# EAGLE design BSeriesPlug (EAGLE 9.6.2)
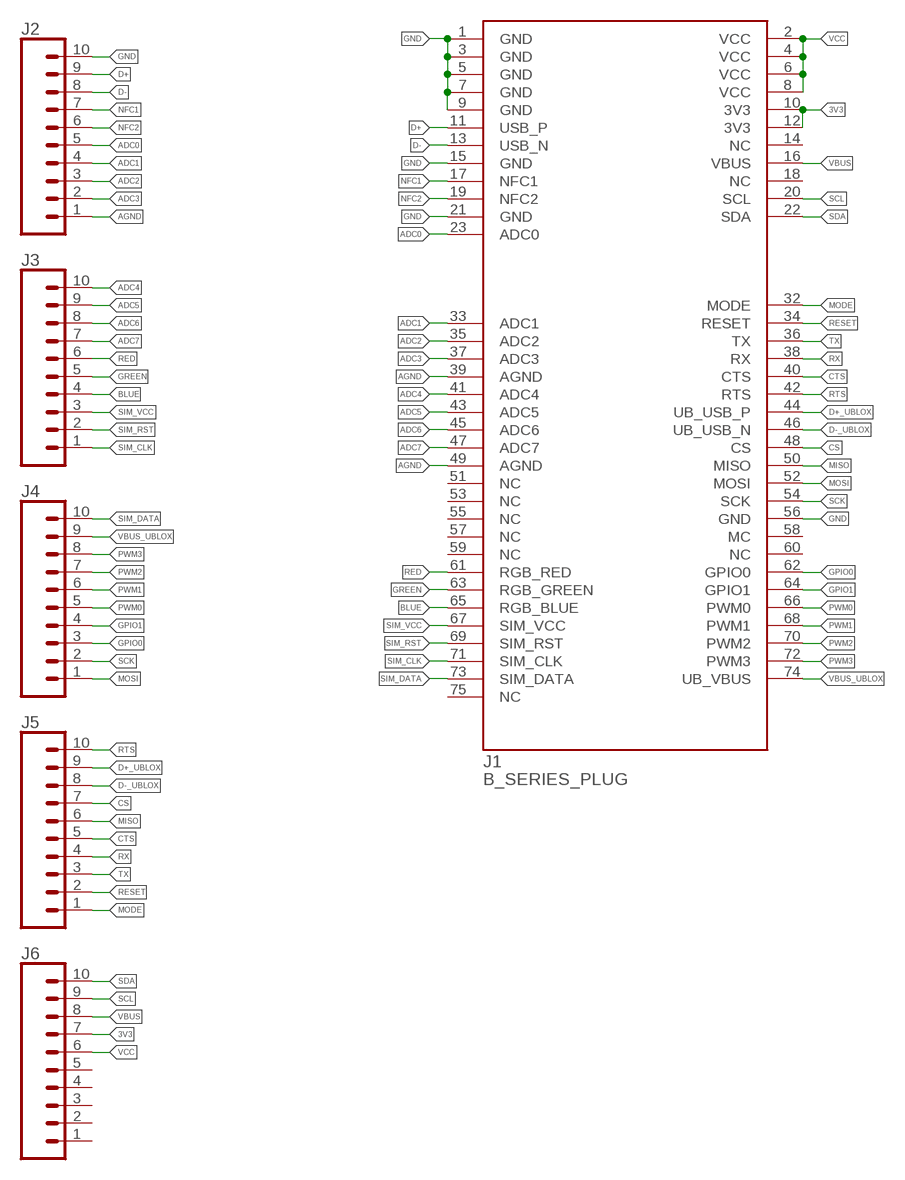
[diagram p0: schematic, sheet 1]

## Parts
J1  B_SERIES_PLUG  [M.2-CARD-E-22]
J2  CONN_10"  [1X10]
J3  CONN_10"  [1X10]
J4  CONN_10"  [1X10]
J5  CONN_10"  [1X10]
J6  CONN_10"  [1X10]

## Nets
3V3: J1.10(3V3) J1.12(3V3) J6.7
ADC0: J1.23(ADC0) J2.5
ADC1: J1.33(ADC1) J2.4
ADC2: J1.35(ADC2) J2.3
ADC3: J1.37(ADC3) J2.2
ADC4: J1.41(ADC4) J3.10
ADC5: J1.43(ADC5) J3.9
ADC6: J1.45(ADC6) J3.8
ADC7: J1.47(ADC7) J3.7
AGND: J1.39(AGND) J1.49(AGND) J2.1
BLUE: J1.65(RGB_BLUE) J3.4
CS: J1.48(CS) J5.7
CTS: J1.40(CTS) J5.5
D+: J1.11(USB_P) J2.9
D+_UBLOX: J1.44(UB_USB_P) J5.9
D-: J1.13(USB_N) J2.8
D-_UBLOX: J1.46(UB_USB_N) J5.8
GND: J1.1(GND) J1.3(GND) J1.5(GND) J1.7(GND) J1.9(GND) J1.15(GND) J1.21(GND) J1.56(GND) J2.10
GPIO0: J1.62(GPIO0) J4.3
GPIO1: J1.64(GPIO1) J4.4
GREEN: J1.63(RGB_GREEN) J3.5
MISO: J1.50(MISO) J5.6
MODE: J1.32(MODE) J5.1
MOSI: J1.52(MOSI) J4.1
NFC1: J1.17(NFC1) J2.7
NFC2: J1.19(NFC2) J2.6
PWM0: J1.66(PWM0) J4.5
PWM1: J1.68(PWM1) J4.6
PWM2: J1.70(PWM2) J4.7
PWM3: J1.72(PWM3) J4.8
RED: J1.61(RGB_RED) J3.6
RESET: J1.34(RESET) J5.2
RTS: J1.42(RTS) J5.10
RX: J1.38(RX) J5.4
SCK: J1.54(SCK) J4.2
SCL: J1.20(SCL) J6.9
SDA: J1.22(SDA) J6.10
SIM_CLK: J1.71(SIM_CLK) J3.1
SIM_DATA: J1.73(SIM_DATA) J4.10
SIM_RST: J1.69(SIM_RST) J3.2
SIM_VCC: J1.67(SIM_VCC) J3.3
TX: J1.36(TX) J5.3
VBUS: J1.16(VBUS) J6.8
VBUS_UBLOX: J1.74(UB_VBUS) J4.9
VCC: J1.2(VCC) J1.4(VCC) J1.6(VCC) J1.8(VCC) J6.6
Unconnected: J1.14(NC) J1.18(NC) J1.51(NC) J1.53(NC) J1.55(NC) J1.57(NC) J1.58(MC) J1.59(NC) J1.60(NC) J1.75(NC) J6.1 J6.2 J6.3 J6.4 J6.5

## Library data of the parts
J1 = bschulz:B_SERIES_PLUG
J2-J6 = bschulz:CONN_10: Genaric 10 terminal header Digikey 2.54_SCREW <https://www.digikey.com/product-detail/en/on-shore-technology-inc/OSTVN10A150/ED10567-ND/1588870> 3.5_SCREW <https://www.digikey.com/product-detail/en/on-shore-technology-inc/OSTTE100104/ED2735-ND/2351811>; PROD_ID: CONN-11563

## Board
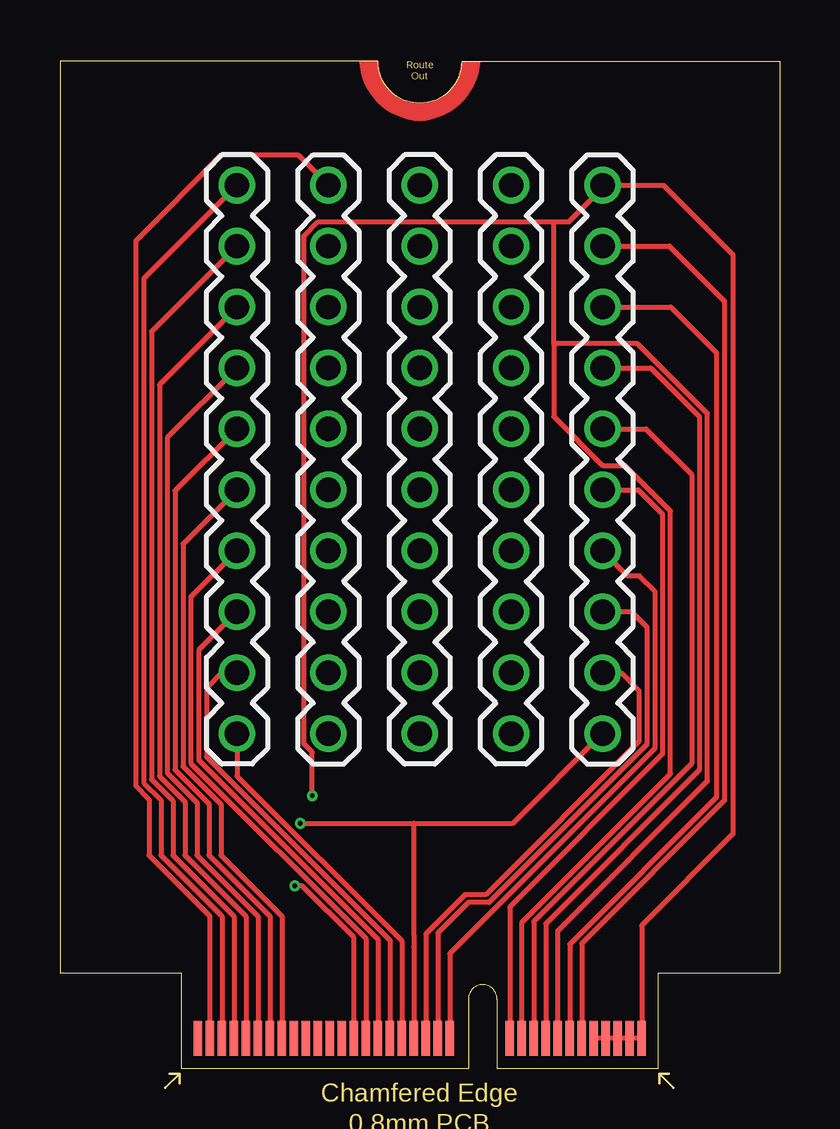
[diagram p1: board, top side]
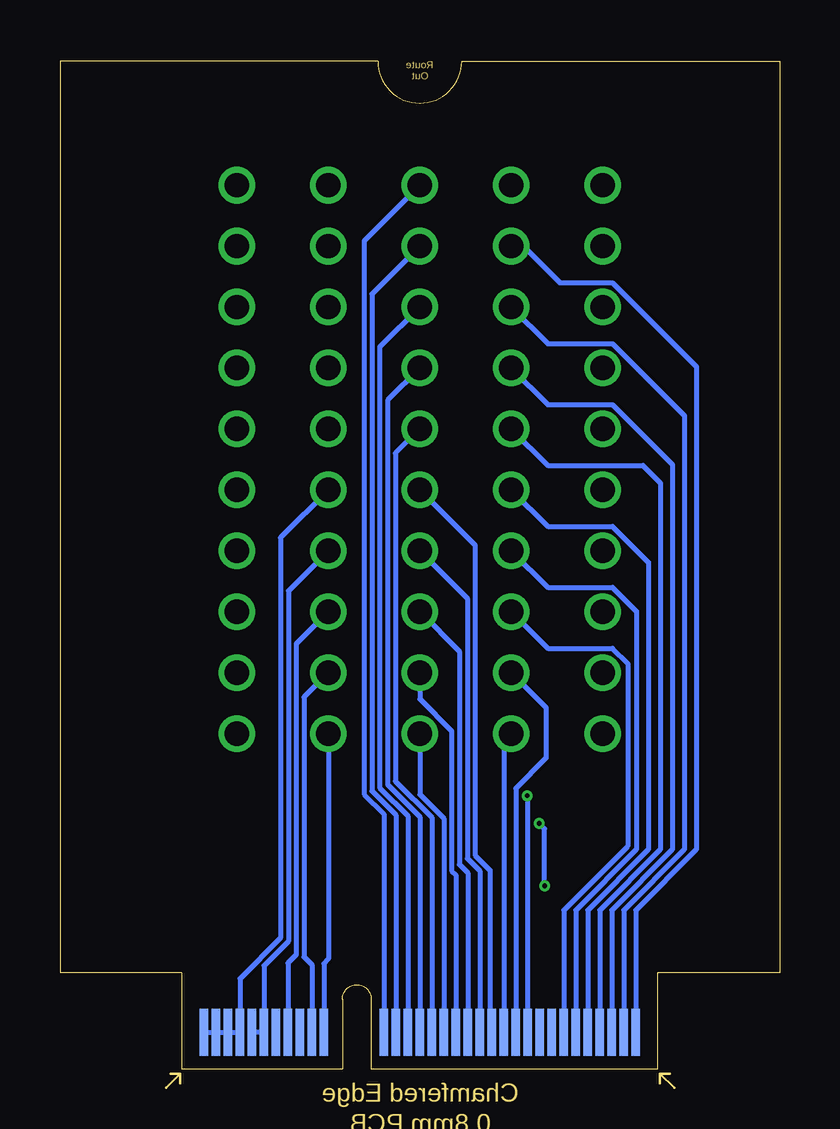
[diagram p2: board, bottom side, seen from below]

Size 30 x 42 mm. Coordinates in mm from the lower left corner, seen from the top.
Copper layers (1*16): Top 0.035559375mm / dielectric 1.6mm / Bottom 0.035559375mm
Design rules "jlcpcb-2layer": minimum track width 5mil, minimum drill 0.2mm, track to track 5mil, track to pad 6mil, pad to pad 5mil, via to via 6mil, smd to smd 5mil, copper to edge 15mil, drill to drill 6mil, minimum pad ring 5mil, minimum via ring 5mil, stop-mask expansion 2.5mil, vias tented up to drill 0mil, thermal gap 10mil

### Footprints (pad centres in the part's own frame; a part is rotated, then mirrored left to right if it is on the bottom)
M.2-CARD-E-22 = smd 0.35 x 1.45: 1 9.25,1.275; 3 8.75,1.275; 5 8.25,1.275; 7 7.75,1.275; 9 7.25,1.275; 11 6.75,1.275; 13 6.25,1.275; 15 5.75,1.275; 17 5.25,1.275; 19 4.75,1.275; 21 4.25,1.275; 23 3.75,1.275; 33 1.25,1.275; 35 0.75,1.275; 37 0.25,1.275; 39 -0.25,1.275; 41 -0.75,1.275; 43 -1.25,1.275; 45 -1.75,1.275; 47 -2.25,1.275; 49 -2.75,1.275; 51 -3.25,1.275; 53 -3.75,1.275; 55 -4.25,1.275; 57 -4.75,1.275; 59 -5.25,1.275; 61 -5.75,1.275; 63 -6.25,1.275; 65 -6.75,1.275; 67 -7.25,1.275; 69 -7.75,1.275; 71 -8.25,1.275; 73 -8.75,1.275; 75 -9.25,1.275 | smd 0.35 x 1.95 bottom: 2 9,1.525; 4 8.5,1.525; 6 8,1.525; 8 7.5,1.525; 10 7,1.525; 12 6.5,1.525; 14 6,1.525; 16 5.5,1.525; 18 5,1.525; 20 4.5,1.525; 22 4,1.525; 32 1.5,1.525; 34 1,1.525; 36 0.5,1.525; 38 0,1.525; 40 -0.5,1.525; 42 -1,1.525; 44 -1.5,1.525; 46 -2,1.525; 48 -2.5,1.525; 50 -3,1.525; 52 -3.5,1.525; 54 -4,1.525; 56 -4.5,1.525; 58 -5,1.525; 60 -5.5,1.525; 62 -6,1.525; 64 -6.5,1.525; 66 -7,1.525; 68 -7.5,1.525; 70 -8,1.525; 72 -8.5,1.525; 74 -9,1.525
1X10 = drill 1.016: 1 0,0; 2 2.54,0; 3 5.08,0; 4 7.62,0; 5 10.16,0; 6 12.7,0; 7 15.24,0; 8 17.78,0; 9 20.32,0; 10 22.86,0

### Placement (x,y rotation side)
J1  15,0 0 top
J2  22.62,13.97 90 top
J3  7.38,36.83 270 top
J4  11.19,13.97 90 top
J5  15,36.83 270 top
J6  18.81,36.83 270 top

### Tracks (layer width: path | path; a pad name or v marks a point on that pad's centre or on a via)
3V3
  Bottom 0.2: J6.7 20.48,19.92 20.48,5.32 21.5,4.29 J1.12 J1.10
ADC0
  Top 0.2: J2.5 24.11,24.13 25.12,23.11 25.12,13.12 18.75,6.74 J1.23
ADC1
  Top 0.2: J2.4 23.66,20.55 24.16,20.55 24.8,19.91 24.8,13.35 16.25,4.81 J1.33
ADC2
  Top 0.2: J2.3 23.83,19.05 24.47,18.41 24.47,13.51 17.89,6.93 17.02,6.93 15.75,5.66 J1.35
ADC3
  Top 0.2: J2.2 23.38,16.51 24.14,15.75 24.14,13.65 17.75,7.26 16.89,7.26 15.25,5.62 J1.37
ADC4
  Top 0.2: J3.10 7.38,12.19 14.25,5.32 J1.41
ADC5
  Top 0.2: J3.9 6.74,16.51 6.11,15.88 6.11,13 13.75,5.36 J1.43
ADC6
  Top 0.2: J3.8 5.78,17.45 5.78,12.86 13.25,5.4 J1.45
ADC7
  Top 0.2: J3.7 5.46,19.67 5.46,12.73 12.75,5.43 J1.47
AGND  (via drill 0.2)
  Top 0.2: J1.39 14.75,5.08 14.75,5.58 14.75,10.22 14.75,10.23 | J1.49 12.25,5.47 10.1,7.62 v9.79,7.62 | v10.02,10.23 14.75,10.23 | 14.75,10.23 18.88,10.23 J2.1
  Bottom 0.2: v9.79,7.62 9.79,10 v10.02,10.23
BLUE
  Top 0.2: J3.4 4.47,26.3 4.47,12.32 5.71,11.09 5.71,8.89 8.25,6.36 J1.65
CS
  Bottom 0.2: J5.7 13.02,19.61 13.02,8.76 12.5,8.24 J1.48
CTS
  Bottom 0.2: J5.5 16.01,25.66 16.01,11.98 14.5,10.47 J1.40
D+
  Top 0.2: J2.9 25.41,34.29 27.7,32 27.7,11.18 21.75,5.23 J1.11
D+_UBLOX
  Bottom 0.2: J5.9 15,15.4 13.67,14.08 13.67,8.26 13.5,8.08 J1.44
D-
  Top 0.2: J2.8 25.47,31.75 27.37,29.84 27.37,11.31 21.25,5.19 J1.13
D-_UBLOX
  Bottom 0.2: J5.8 13.35,17.4 13.35,8.51 13,8.16 J1.46
GND  (via drill 0.2)
  Top 0.2: J2.10 22.75,36.83 | 22.75,36.83 25.16,36.83 28.06,33.93 28.06,9.78 24.25,5.97 J1.1 J1.3 J1.5 J1.7 J1.9 | v10.52,11.38 10.52,13.21 10.18,13.55 10.18,34.71 10.77,35.3 20.59,35.3 | 22.75,36.83 21.22,35.3 20.59,35.3 | J1.15 20.75,5.75 26.99,11.99 26.99,27.31 24.08,30.22 20.59,30.22 20.59,30.23 | J1.21 19.25,6.1 25.45,12.3 25.45,23.25 23.55,25.14 22.62,25.14 20.59,27.18 20.59,30.23 | 20.59,30.23 20.59,35.3
  Bottom 0.2: J1.56 10.5,11.36 v10.52,11.38
GPIO0
  Bottom 0.2: J4.3 9.66,17.52 6.96,17.52 6.33,16.9 6.33,9.27 9,6.61 J1.62
GPIO1
  Bottom 0.2: J4.4 9.66,20.06 6.96,20.06 5.96,19.07 5.96,9.14 8.5,6.61 J1.64
GREEN
  Top 0.2: J3.5 4.8,24.09 4.8,12.46 6.21,11.05 6.21,8.89 8.75,6.36 J1.63
MISO
  Bottom 0.2: J5.6 12.69,21.82 12.69,8.9 12.07,8.28 12.07,1.6 J1.50
MODE
  Bottom 0.2: J5.1 17.32,34.51 17.32,11.44 16.5,10.62 J1.32
MOSI
  Bottom 0.2: J4.1 11.5,13.66 J1.52
NFC1
  Top 0.2: J2.7 24.63,29.21 26.66,27.18 26.66,12.46 20.25,6.05 J1.17
NFC2
  Top 0.2: J2.6 24.43,26.67 26.34,24.77 26.34,12.72 19.75,6.14 J1.19
PWM0
  Bottom 0.2: J4.5 9.66,22.6 6.96,22.6 5.46,21.11 5.46,9.14 8,6.61 J1.66
PWM1
  Bottom 0.2: J4.6 9.66,25.14 5.69,25.14 4.96,24.41 4.96,9.14 7.5,6.61 J1.68
PWM2
  Bottom 0.2: J4.7 9.66,27.68 6.96,27.68 4.46,25.18 4.46,9.14 7,6.61 J1.70
PWM3
  Bottom 0.2: J4.8 9.66,30.22 6.96,30.22 3.96,27.23 3.96,9.14 6.5,6.61 J1.72
RED
  Top 0.2: J3.6 5.13,21.88 5.13,12.59 6.71,11.01 6.71,8.89 9.25,6.36 J1.61
RESET
  Bottom 0.2: J5.2 17,32.3 17,11.58 16,10.58 J1.34
RTS
  Bottom 0.2: J5.10 15,11.43 14,10.43 J1.42
RX
  Bottom 0.2: J5.4 16.34,27.87 16.34,11.85 15,10.51 J1.38
SCK
  Bottom 0.2: J4.2 9.73,15.05 9.73,12.96 11,11.69 J1.54
SCL
  Bottom 0.2: J6.9 19.82,15.5 19.82,4.66 19.5,4.33 J1.20
SDA
  Bottom 0.2: J6.10 18.81,4.57 19,4.38 J1.22
SIM_CLK
  Top 0.2: J3.1 3.49,32.94 3.49,11.92 4.21,11.2 4.21,8.89 6.75,6.36 J1.71
SIM_DATA
  Top 0.2: J1.73 6.25,6.36 3.71,8.89 3.71,11.24 3.17,11.78 3.17,34.52 6.74,38.1 9.92,38.1 J4.10
SIM_RST
  Top 0.2: J3.2 3.82,30.73 3.82,12.05 4.71,11.16 4.71,8.89 7.25,6.36 J1.69
SIM_VCC
  Top 0.2: J3.3 4.15,28.52 4.15,12.19 5.21,11.12 5.21,8.89 7.75,6.36 J1.67
TX
  Bottom 0.2: J5.3 16.67,30.08 16.67,11.71 15.5,10.54 J1.36
VBUS
  Bottom 0.2: J6.8 20.15,17.71 20.15,4.75 20.5,4.41 J1.16
VBUS_UBLOX
  Bottom 0.2: J4.9 10.68,34.29 9.16,32.76 6.96,32.76 3.46,29.27 3.46,9.14 6,6.61 J1.74
VCC
  Bottom 0.2: J6.6 20.8,22.14 20.8,5.45 22.5,3.76 J1.8 J1.6 J1.4 J1.2

### Text on the board
tDocu: Break44 | BSeriesPlug / v0.0 | Front Towards Squid